# Altium project ExtendBoard.PrjPCB
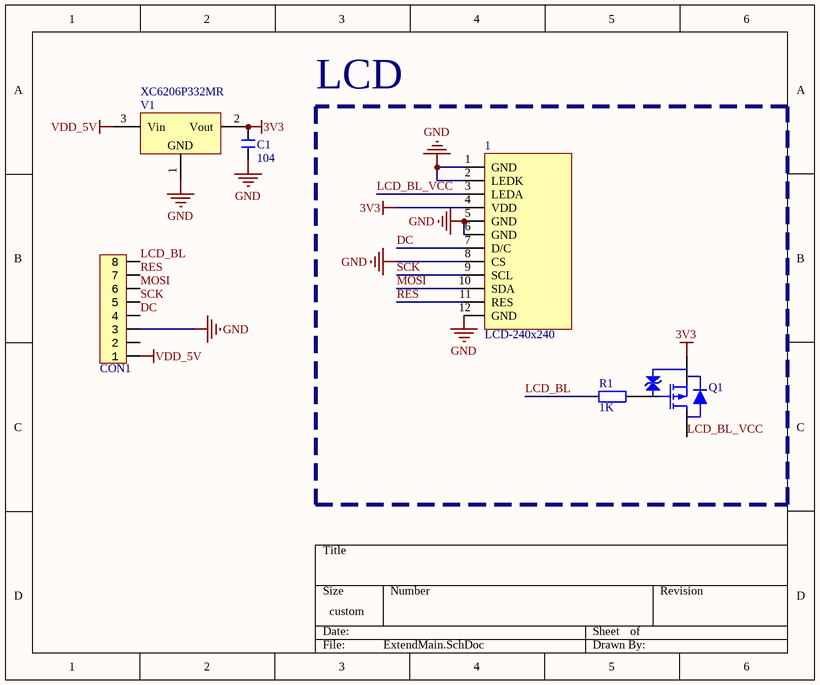
[diagram p0: ExtendMain.SchDoc]
1 sheet, 6 parts. Net scope: global (net labels, ports and power ports of the same name join across sheets).
Board file: ExtendBoard.PcbDoc

## Sheet ExtendMain.SchDoc
size 152 x 127 mm

### Parts
1  LCD-240x240  [LCD-240x240-NoHole]
C1  104  [C 0402_M]
CON1  FFC_0.5_8  [FFC_0.5_8]  (value not drawn)
Q1  AO3415A  [SOT23-3]  (value not drawn)
R1  1K  [RES_0402]
V1  XC6206P332MR  [SOT23-3L]

### Blocks framed on the sheet
LCD: 1 Q1 R1

### Nets
3V3: 1.4(VDD) C1.2 Q1.2(S) V1.2(Vout)
GND: 1.1(GND) 1.2(LEDK) 1.5(GND) 1.6(GND) 1.8(CS) 1.12(GND) C1.1 CON1.3 V1.1(GND)
VDD_5V: CON1.1 V1.3(Vin)
DC: 1.7(D/C) CON1.4
LCD_BL: CON1.8 R1.1
LCD_BL_VCC: 1.3(LEDA) Q1.3(D)
MOSI: 1.10(SDA) CON1.6
RES: 1.11(RES) CON1.7
SCK: 1.9(SCL) CON1.5
NetQ1_1: Q1.1(G) R1.2

Not connected (* = marked no-connect by the designer): CON1 2

### Library data of the parts
1 = LCD-240x240: 显示屏
C1 = C: 无极性贴片电容; 材质: X7R; BOM名称: 无极性贴片电容
CON1 = FFC_0.5_8: FFC; System: Connector
Q1 = AO3415A: MOSFET; Published: 8-Jun-2000; LatestRevisionDate: 17-Jul-2002; LatestRevisionNote: Re-released for DXP Platform.; PackageVersion: 1995/1996; PackageReference: E3; Publisher: Altium Limited; PackageDescription: TO, Flat Index; 3 In-Line, Axial Leads; Body Dia. 4.6mm; Lead Dia. 0.5 mm (max)
R1 = 电阻-0402: Resistor; Value: 22R
V1 = XC6206P332MR: 低压差线性稳压芯片; BOM名称: 低压差线性稳压芯片